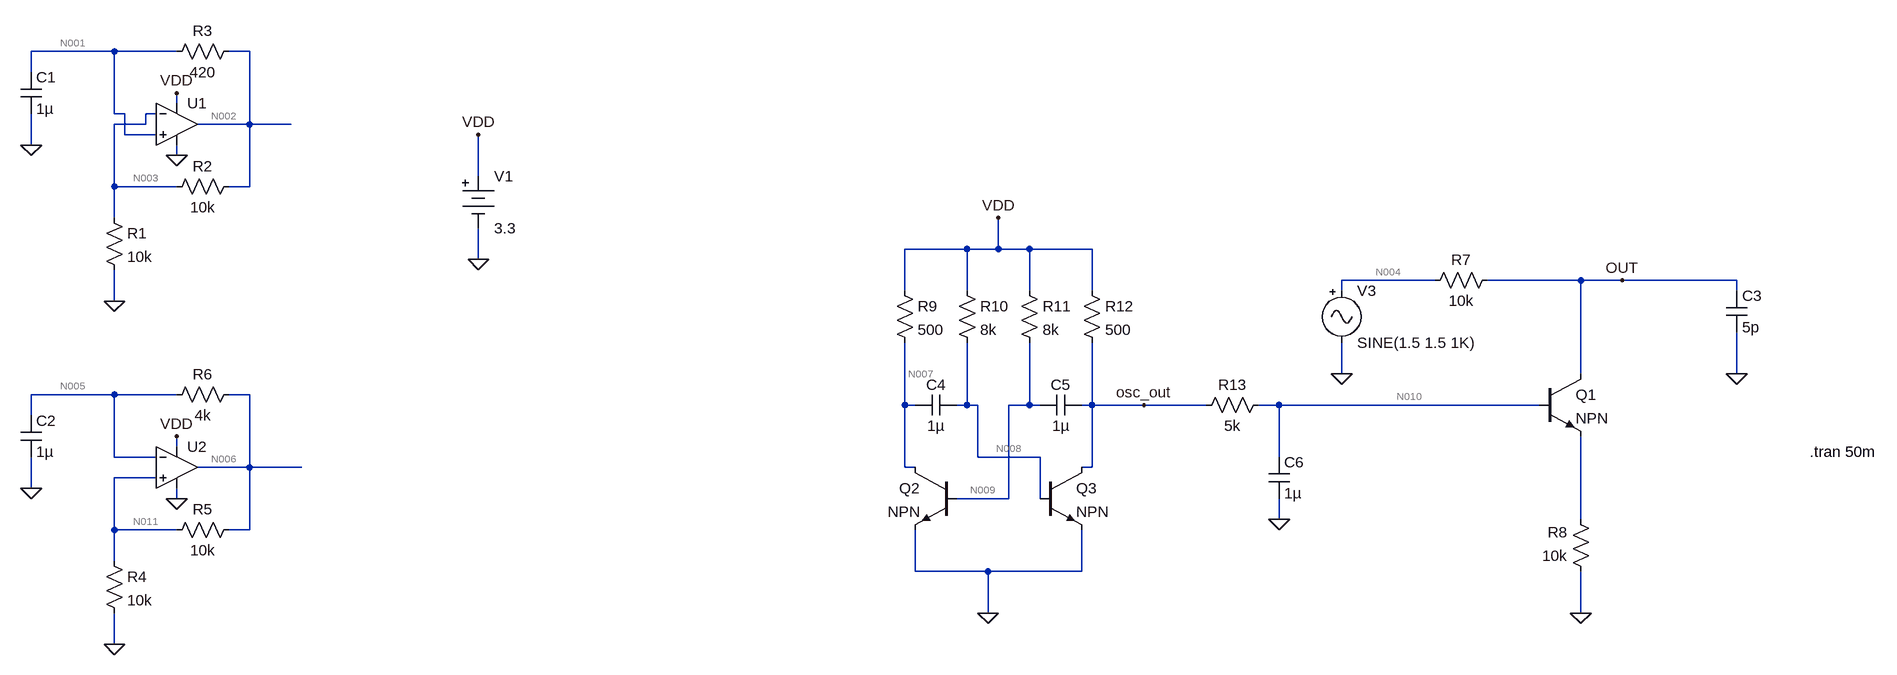
[diagram p0: schematic simulation.asc]
simulation.asc, the LTspice schematic file:
Version 4
SHEET 1 1872 852
WIRE -864 -224 -992 -224
WIRE -768 -224 -864 -224
WIRE -656 -224 -688 -224
WIRE -992 -192 -992 -224
WIRE -768 -144 -768 -160
WIRE -864 -128 -864 -224
WIRE -848 -128 -864 -128
WIRE -800 -128 -816 -128
WIRE -816 -112 -816 -128
WIRE -816 -112 -864 -112
WIRE -656 -112 -656 -224
WIRE -656 -112 -736 -112
WIRE -592 -112 -656 -112
WIRE -848 -96 -848 -128
WIRE -800 -96 -848 -96
WIRE -992 -80 -992 -128
WIRE -768 -64 -768 -80
WIRE -304 -32 -304 -96
WIRE -864 -16 -864 -112
WIRE -768 -16 -864 -16
WIRE -656 -16 -656 -112
WIRE -656 -16 -688 -16
WIRE -864 32 -864 -16
WIRE 448 80 352 80
WIRE 496 80 496 32
WIRE 496 80 448 80
WIRE 544 80 496 80
WIRE 640 80 544 80
WIRE -304 96 -304 48
WIRE 1168 128 1024 128
WIRE 1392 128 1248 128
WIRE 1456 128 1392 128
WIRE 1632 128 1456 128
WIRE 352 144 352 80
WIRE 448 144 448 80
WIRE 544 144 544 80
WIRE 640 144 640 80
WIRE 1024 144 1024 128
WIRE 1632 144 1632 128
WIRE -864 160 -864 112
WIRE 1024 272 1024 224
WIRE 1392 272 1392 128
WIRE 1632 272 1632 208
WIRE -864 304 -992 304
WIRE -768 304 -864 304
WIRE -656 304 -688 304
WIRE 352 320 352 224
WIRE 368 320 352 320
WIRE 448 320 448 224
WIRE 448 320 432 320
WIRE 464 320 448 320
WIRE 544 320 544 224
WIRE 544 320 512 320
WIRE 560 320 544 320
WIRE 640 320 640 224
WIRE 640 320 624 320
WIRE 720 320 640 320
WIRE 816 320 720 320
WIRE 928 320 896 320
WIRE 1328 320 928 320
WIRE -992 336 -992 304
WIRE -768 384 -768 368
WIRE -864 400 -864 304
WIRE -800 400 -864 400
WIRE 464 400 464 320
WIRE 560 400 464 400
WIRE 928 400 928 320
WIRE -656 416 -656 304
WIRE -656 416 -736 416
WIRE -576 416 -656 416
WIRE 352 416 352 320
WIRE 368 416 352 416
WIRE 640 416 640 320
WIRE 640 416 624 416
WIRE -800 432 -864 432
WIRE -992 448 -992 400
WIRE -768 464 -768 448
WIRE 512 464 512 320
WIRE 512 464 432 464
WIRE 560 464 560 400
WIRE 928 496 928 464
WIRE 1392 496 1392 368
WIRE -864 512 -864 432
WIRE -768 512 -864 512
WIRE -656 512 -656 416
WIRE -656 512 -688 512
WIRE -864 560 -864 512
WIRE 368 576 368 512
WIRE 480 576 368 576
WIRE 624 576 624 512
WIRE 624 576 480 576
WIRE 480 640 480 576
WIRE 1392 640 1392 576
WIRE -864 688 -864 640
FLAG -992 -80 0
FLAG -864 160 0
FLAG -992 448 0
FLAG -864 688 0
FLAG 1392 640 0
FLAG 1632 272 0
FLAG 1456 128 OUT
FLAG -768 -64 0
FLAG -768 464 0
FLAG -768 -160 VDD
FLAG -768 368 VDD
FLAG -304 96 0
FLAG -304 -96 VDD
FLAG 1024 272 0
FLAG 496 32 VDD
FLAG 480 640 0
FLAG 720 320 osc_out
FLAG 928 496 0
SYMBOL res -880 16 R0
SYMATTR InstName R1
SYMATTR Value 10k
SYMBOL res -672 -32 R90
WINDOW 0 0 56 VBottom 2
WINDOW 3 32 56 VTop 2
SYMATTR InstName R2
SYMATTR Value 10k
SYMBOL res -672 -240 R90
WINDOW 0 0 56 VBottom 2
WINDOW 3 32 56 VTop 2
SYMATTR InstName R3
SYMATTR Value 420
SYMBOL cap -1008 -192 R0
SYMATTR InstName C1
SYMATTR Value 1µ
SYMBOL res -880 544 R0
SYMATTR InstName R4
SYMATTR Value 10k
SYMBOL res -672 496 R90
WINDOW 0 0 56 VBottom 2
WINDOW 3 32 56 VTop 2
SYMATTR InstName R5
SYMATTR Value 10k
SYMBOL res -672 288 R90
WINDOW 0 0 56 VBottom 2
WINDOW 3 32 56 VTop 2
SYMATTR InstName R6
SYMATTR Value 4k
SYMBOL cap -1008 336 R0
SYMATTR InstName C2
SYMATTR Value 1µ
SYMBOL npn 1328 272 R0
SYMATTR InstName Q1
SYMBOL res 1408 592 R180
WINDOW 0 36 76 Left 2
WINDOW 3 36 40 Left 2
SYMATTR InstName R8
SYMATTR Value 10k
SYMBOL cap 1616 144 R0
SYMATTR InstName C3
SYMATTR Value 5p
SYMBOL Opamps\\UniversalOpamp2 -768 -112 R0
SYMATTR InstName U1
SYMBOL Opamps\\UniversalOpamp2 -768 416 R0
SYMATTR InstName U2
SYMBOL Misc\\battery -304 -48 R0
WINDOW 123 0 0 Left 0
WINDOW 39 0 0 Left 0
SYMATTR InstName V1
SYMATTR Value 3.3
SYMBOL res 1264 112 R90
WINDOW 0 0 56 VBottom 2
WINDOW 3 32 56 VTop 2
SYMATTR InstName R7
SYMATTR Value 10k
SYMBOL Misc\\signal 1024 128 R0
WINDOW 123 0 0 Left 0
WINDOW 39 0 0 Left 0
SYMATTR InstName V3
SYMATTR Value SINE(1.5 1.5 1K)
SYMBOL npn 432 416 M0
SYMATTR InstName Q2
SYMBOL npn 560 416 R0
SYMATTR InstName Q3
SYMBOL cap 432 304 R90
WINDOW 0 0 32 VBottom 2
WINDOW 3 32 32 VTop 2
SYMATTR InstName C4
SYMATTR Value 1µ
SYMBOL cap 624 304 R90
WINDOW 0 0 32 VBottom 2
WINDOW 3 32 32 VTop 2
SYMATTR InstName C5
SYMATTR Value 1µ
SYMBOL res 336 128 R0
SYMATTR InstName R9
SYMATTR Value 500
SYMBOL res 432 128 R0
SYMATTR InstName R10
SYMATTR Value 8k
SYMBOL res 528 128 R0
SYMATTR InstName R11
SYMATTR Value 8k
SYMBOL res 624 128 R0
SYMATTR InstName R12
SYMATTR Value 500
SYMBOL res 912 304 R90
WINDOW 0 0 56 VBottom 2
WINDOW 3 32 56 VTop 2
SYMATTR InstName R13
SYMATTR Value 5k
SYMBOL cap 912 400 R0
SYMATTR InstName C6
SYMATTR Value 1µ
TEXT 1744 392 Left 2 !.tran 50m

The netlist it stands for:
* simulation.asc
R1 N003 0 10k
R2 N002 N003 10k
R3 N002 N001 420
C1 N001 0 1µ
R4 N011 0 10k
R5 N006 N011 10k
R6 N006 N005 4k
C2 N005 0 1µ
Q1 OUT N010 N012 0 NPN
R8 0 N012 10k
C3 OUT 0 5p
XU1 N001 N003 VDD 0 N002 level.2 Avol=1Meg GBW=10Meg Slew=10Meg ilimit=25m rail=0 Vos=0 phimargin=45 en=0 enk=0 in=0 ink=0 Rin=500Meg  ; pins IN+ IN- V+ V- OUT
XU2 N011 N005 VDD 0 N006 level.2 Avol=1Meg GBW=10Meg Slew=10Meg ilimit=25m rail=0 Vos=0 phimargin=45 en=0 enk=0 in=0 ink=0 Rin=500Meg  ; pins IN+ IN- V+ V- OUT
V1 VDD 0 3.3
R7 OUT N004 10k
V3 N004 0 SINE(1.5 1.5 1K)
Q2 N007 N009 0 0 NPN
Q3 osc_out N008 0 0 NPN
C4 N008 N007 1µ
C5 osc_out N009 1µ
R9 VDD N007 500
R10 VDD N008 8k
R11 VDD N009 8k
R12 VDD osc_out 500
R13 N010 osc_out 5k
C6 N010 0 1µ
.model NPN NPN
.model PNP PNP
.lib standard.bjt
.tran 50m
.lib UniversalOpamps2.sub
.backanno
.end

* Results of the author's LTspice run, read from the files saved beside the schematic
* Operating Point, zero values left out:
*   V(n003) = 1.649 V
*   V(n002) = 3.298 V
*   V(n001) = 3.298 V
*   V(n011) = 2.689 mV
*   V(n006) = 5.346 mV
*   V(n005) = 5.359 mV
*   V(out) = 1.5 V
*   V(n010) = 86.85 mV
*   V(vdd) = 3.3 V
*   V(n004) = 1.5 V
*   V(n007) = 86.85 mV
*   V(n009) = 824.2 mV
*   V(osc_out) = 86.85 mV
*   V(n008) = 824.2 mV
*   Ic(Q3) = 6.426 mA
*   Ib(Q3) = 309.5 µA
*   Ie(Q3) = -6.736 mA
*   Ic(Q2) = 6.426 mA
*   Ib(Q2) = 309.5 µA
*   Ie(Q2) = -6.736 mA
*   Ic(Q1) = 1.416 pA
*   Ib(Q1) = -1.326 pA
*   I(R13) = 1.326 pA
*   I(R12) = 6.426 mA
*   I(R11) = 309.5 µA
*   I(R10) = 309.5 µA
*   I(R9) = 6.426 mA
*   I(R7) = -1.416 pA
*   I(R6) = -3.289 nA
*   I(R5) = 265.6 nA
*   I(R4) = 268.9 nA
*   I(R3) = 3.296 nA
*   I(R2) = 164.9 µA
*   I(R1) = 164.9 µA
*   I(V3) = -1.416 pA
*   I(V1) = -13.65 mA
*   Ix(u1:1) = 3.296 nA
*   Ix(u1:2) = -1.805 pA
*   Ix(u1:3) = 165.2 µA
*   Ix(u1:4) = -406.6 nA
*   Ix(u1:5) = -164.9 µA
*   Ix(u2:1) = -3.295 nA
*   Ix(u2:2) = -3.289 nA
*   Ix(u2:3) = 13.43 µA
*   Ix(u2:4) = -13.14 µA
*   Ix(u2:5) = -262.4 nA